# EAGLE design TBA820-Amplifier-2 (EAGLE 7.2.0)
Audio-Verstärker mit TBA820
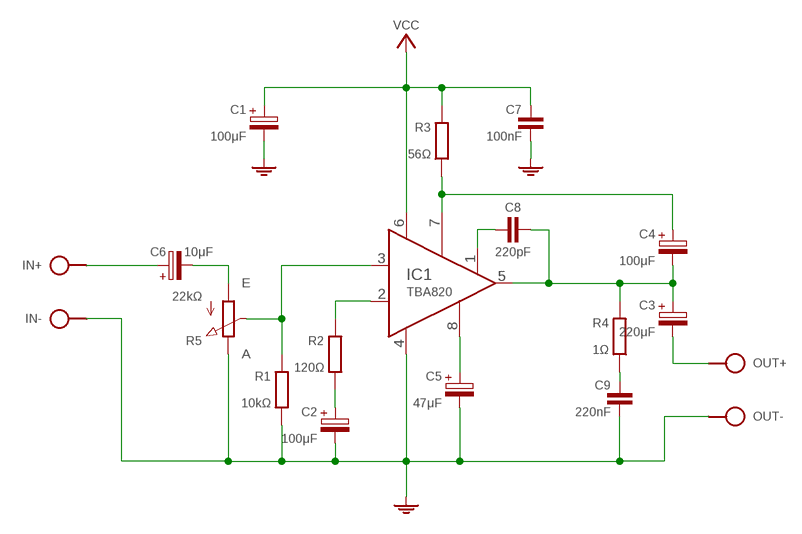
[diagram p0: schematic, sheet 1]

## Parts
C1  100μF  CPOLE2,5-4/V  [E2.5-4/V]
C2  100μF  CPOLE2,5-4/V  [E2.5-4/V]
C3  220μF  CPOLE2.5-5  [E2,5-5]
C4  100μF  CPOLE2,5-4/V  [E2.5-4/V]
C5  47μF  CPOLE2,5-3  [E2,5-3]
C6  10μF  CPOL-HE2,5-3  [E2,5-3]
C7  100nF  C025-024X044  [C025-024X044]
C8  220pF  C-H050-020X044  [C050-020X044]
C9  220nF  C050-024X044  [C050-024X044]
IC1  TBA820  [DIL08]
IN  SPAD+--+  [SPAD-+]
OUT  SPAD+-+-  [SPAD+-]
R1  10kΩ  R0204/10-V  [0204/10-V]
R2  120Ω  R0202/2V  [0202/2V]
R3  56Ω  R0204/10-V  [0204/10-V]
R4  1Ω  R0204/10-V  [0204/10-V]
R5  22kΩ  POT-3P  [CONN-3P]
S4  VCC_GNDPWR-L  [PWR-L]

## Nets
BOOT: C4.+ IC1.7(BOOT) R3.2
FREQ: C8.1 IC1.1(FREQ)
GAIN: IC1.2(GAIN) R2.1
GND: C1.- C2.- C5.- C7.2 C9.2 IC1.4(GND) IN.1 OUT.1 R1.2 R5.3(E) S4.1
INPUT: IC1.3(INPUT) R1.1 R5.2(S)
N$4: C9.1 R4.2
N$5: C6.- R5.1(A)
N$6: C6.+ IN.2
N$10: C3.- OUT.2
N$11: C2.+ R2.2
OUT: C3.+ C4.- C8.2 IC1.5(OUT) R4.1
RIPPLE: C5.+ IC1.8(RIPPLE)
VCC: C1.+ C7.1 IC1.6(VCC) R3.1 S4.2

## Library data of the parts
C1-C5 = c:CPOL: POLARIZED CAPACITOR, European symbol
C6 = c:CPOL-H
C7 C9 = c:C: CAPACITOR, European symbol
C8 = c:C-H
IC1 = ic:TBA820
IN OUT = pad:SPAD+-
R1-R4 = r:R: RESISTOR, European symbol
R5 = r:POT
S4 = pad:VCC_GND

## Board
Audio-Verstärker mit TBA820
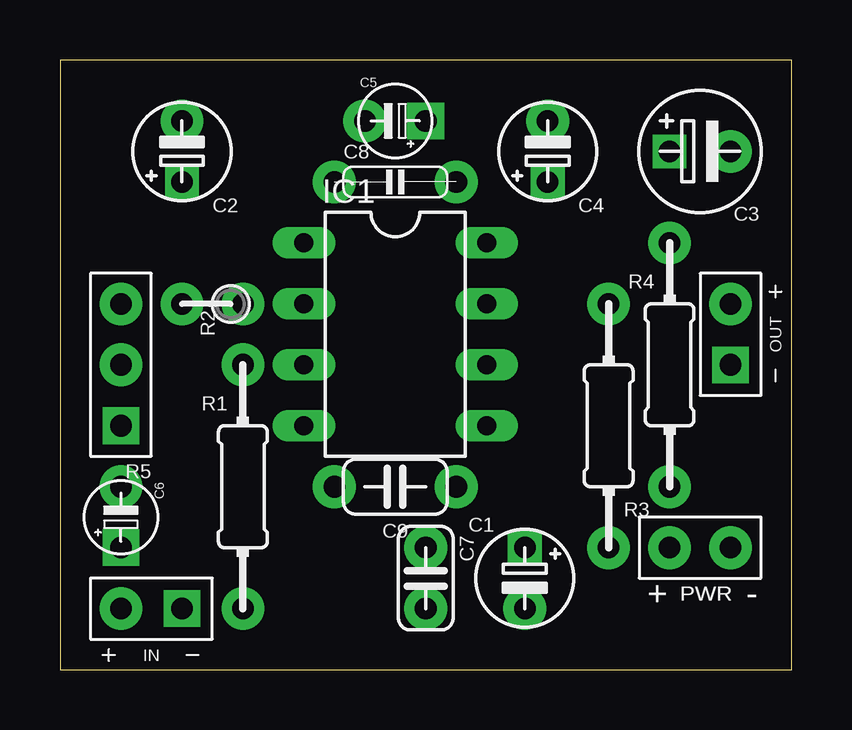
[diagram p1: board, top side]
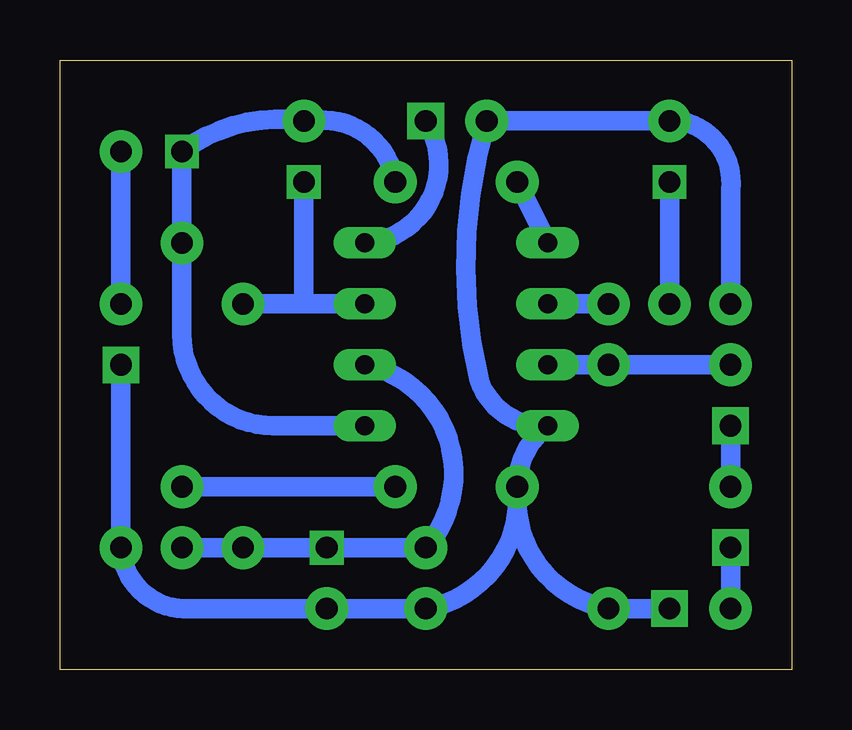
[diagram p2: board, bottom side, seen from below]

Size 30.48 x 25.4 mm. Coordinates in mm from the lower left corner, seen from the top.
Outline: 0,0 30.48,0 30.48,25.4 0,25.4 0,0
Copper layers (1*16): Top 0.035mm / dielectric 1.5mm / Bottom 0.035mm
Design rules "default": minimum track width 10mil, minimum drill 24mil, track to track 8mil, track to pad 8mil, pad to pad 8mil, via to via 8mil, smd to smd 8mil, copper to edge 40mil, drill to drill 8mil, minimum pad ring 10mil, minimum via ring 8mil, stop-mask expansion 4mil, vias tented up to drill 0mil, thermal gap 10mil

### Footprints (pad centres in the part's own frame; a part is rotated, then mirrored left to right if it is on the bottom)
E2.5-4/V = drill 0.9 square: + 0,1.27 | drill 0.9 pad 1.778: - 0,-1.27
E2,5-5 = drill 0.9 square: + 1.27,0 | drill 0.9 pad 1.778: - -1.27,0
E2,5-3 = drill 0.9 pad 1.524 square: + -1.27,0 | drill 0.9 pad 1.778: - 1.27,0
C025-024X044 = drill 0.9 pad 1.778: 1 -1.27,0; 2 1.27,0
C050-020X044 = drill 0.9 pad 1.778: 1 -2.54,0; 2 2.54,0
C050-024X044 = drill 0.9 pad 1.778: 1 -2.54,0; 2 2.54,0
DIL08 = drill 0.8 pad 1.27 long: 1 -3.81,3.81; 2 -3.81,1.27; 3 -3.81,-1.27; 4 -3.81,-3.81; 5 3.81,-3.81; 6 3.81,-1.27; 7 3.81,1.27; 8 3.81,3.81
SPAD-+ = drill 0.9 pad 1.524 square: 1 0,-1.27 | drill 0.9 pad 1.778: 2 0,1.27
SPAD+- = drill 0.9 pad 1.524 square: 1 0,-1.27 | drill 0.9 pad 1.778: 2 0,1.27
0204/10-V = drill 0.9 pad 1.778: 1 0,5.08; 2 0,-5.08
0202/2V = drill 0.9 pad 1.778: 1 0,-1.27; 2 0,1.27
CONN-3P = drill 0.9 pad 1.524 square: 1 0,2.54 | drill 0.9 pad 1.778: 2 0,0; 3 0,-2.54
PWR-L = drill 0.9 pad 1.778: 1 0,0; 2 0,2.54

### Placement (x,y rotation side)
C1  19.37,3.81 0 top
C2  5.08,21.59 180 top
C3  26.67,21.59 180 top
C4  20.32,21.59 180 top
C5  13.97,22.86 180 top
C6  2.54,6.35 90 top
C7  15.24,3.81 270 top
C8  13.97,20.32 0 top
C9  13.97,7.62 180 top
IC1  13.97,13.97 0 top
IN  3.81,2.54 90 top
OUT  27.94,13.97 0 top
R1  7.62,7.62 0 top
R2  6.35,15.24 90 top
R3  22.86,10.16 180 top
R4  25.4,12.7 0 top
R5  2.54,12.7 180 top
S4  27.94,5.08 90 top

### Tracks (layer width: path | path; a pad name or v marks a point on that pad's centre or on a via)
BOOT
  Bottom 0.813: 20.32,15.24 IC1.7 | C4.+ 20.32,15.24 | 20.32,15.24 R3.2
FREQ
  Bottom 0.813: C8.1 IC1.1
GAIN
  Bottom 0.813: IC1.2 R2.1
GND  (via drill 0.38)
  Bottom 0.813: R1.2 6.35,2.54 | R1.2 IN.1 | R5.3 2.54,20 arc-90 4.76,22.86 C2.- C5.- arc-30 13.02,12.06 arc-75 IC1.4 arc-53 C9.2 11.43,6.67 | OUT.1 S4.1 arc-90 25.08,2.54 C1.- C7.2 arc-75 11.43,6.67 | R1.2 arc75 11.43,6.67
  other vias: 19.37,2.54
INPUT
  Bottom 0.813: IC1.3 R1.1 R5.2
N$4
  Bottom 0.813: R4.2 C9.1
N$5
  Bottom 0.813: C6.- R5.1
N$6
  Bottom 0.813: C6.+ IN.2
N$10
  Bottom 0.813: OUT.2 C3.-
N$11
  Bottom 0.813: C2.+ R2.2
OUT
  Bottom 0.813: IC1.5 21.59,10.16 arc90 25.4,13.97 R4.1 C3.+ arc45 C4.- 20,22.86 arc90 C8.2
RIPPLE
  Bottom 0.813: C5.+ arc120 IC1.8
VCC  (via drill 0.38)
  Bottom 0.813: IC1.6 arc120 C7.1 | C1.+ C7.1 | C7.1 R3.1 S4.2
  other vias: 19.37,5.08